# EAGLE design OSD-board (EAGLE 7.2.0)
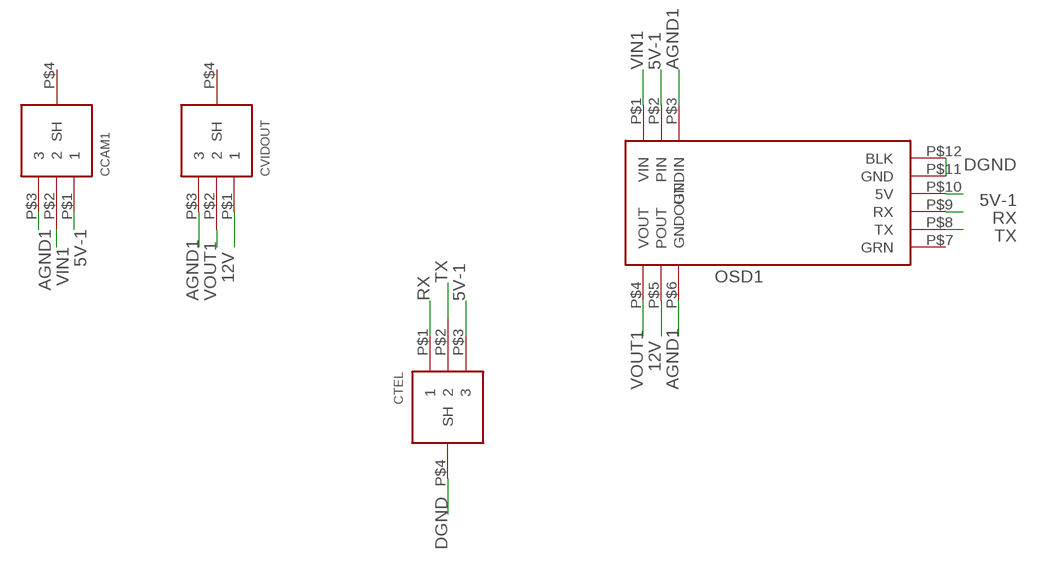
[diagram p0: schematic, sheet 1]

## Parts
CCAM1  TRA3M  [TRA3M]
CTEL  TRA3MBARE  [TRA3M-BARE]
CVIDOUT  TRA3M  [TRA3M]
OSD1  MINIM-OSD  [MINIM-OSD]

## Nets
5V-1: CCAM1.P$1 CTEL.P$3 OSD1.P$2(PIN) OSD1.P$10(5V)
12V: CVIDOUT.P$1 OSD1.P$5(POUT)
AGND1: CCAM1.P$3 CVIDOUT.P$3 OSD1.P$3(GNDIN) OSD1.P$6(GNDOUT)
DGND: CTEL.P$4(SH) OSD1.P$11(GND) OSD1.P$12(BLK)
RX: CTEL.P$1 OSD1.P$9(RX)
TX: CTEL.P$2 OSD1.P$8(TX)
VIN1: CCAM1.P$2 OSD1.P$1(VIN)
VOUT1: CVIDOUT.P$2 OSD1.P$4(VOUT)
Unconnected: CCAM1.P$4(SH) CVIDOUT.P$4(SH) OSD1.P$7(GRN)

## Library data of the parts
CCAM1 CTEL CVIDOUT = custom-parts:TRA3M
OSD1 = custom-parts:MINIM-OSD

## Board
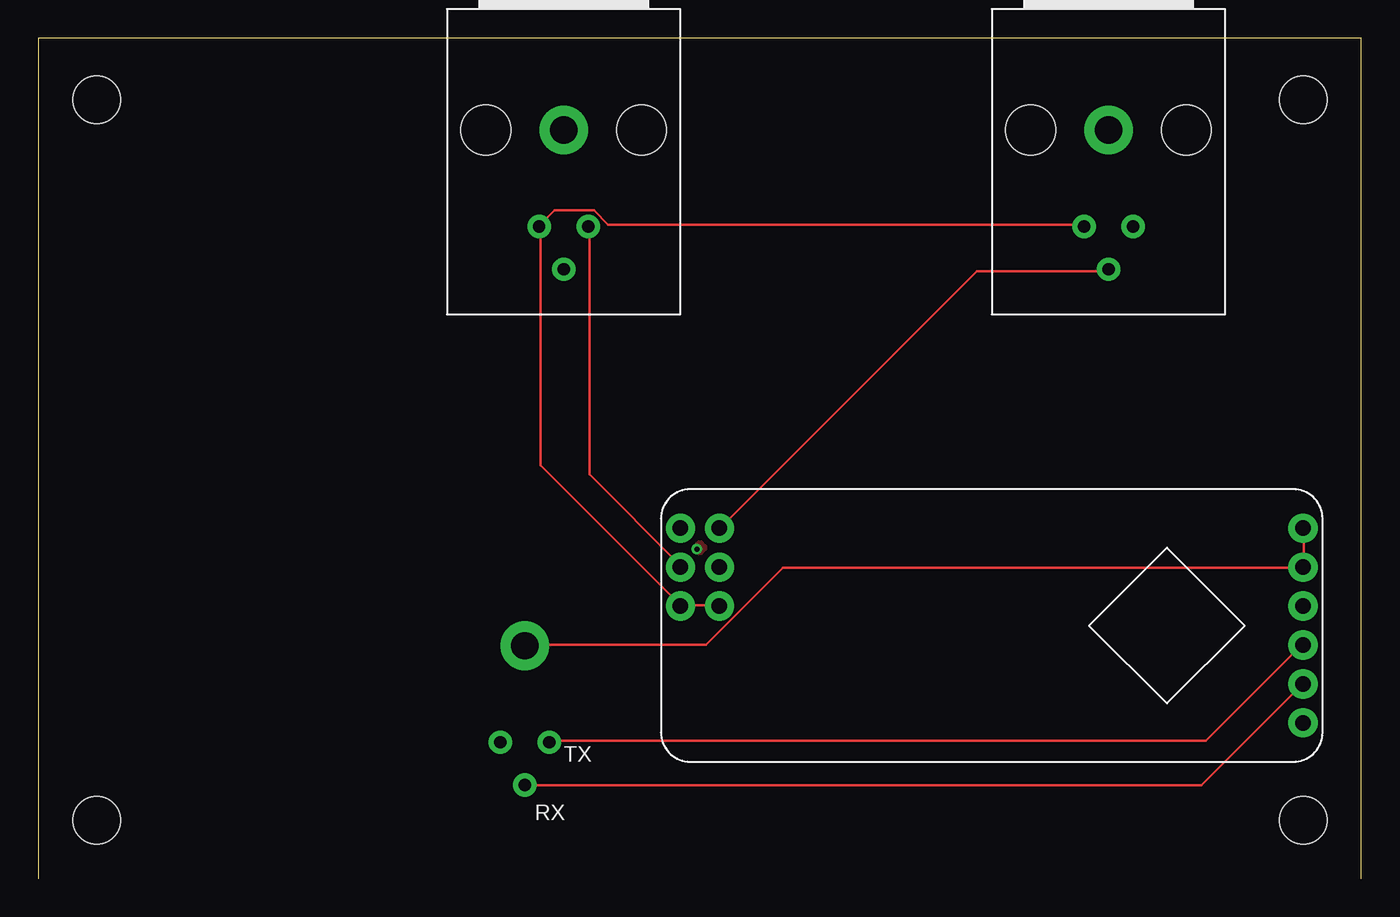
[diagram p1: board, top side]
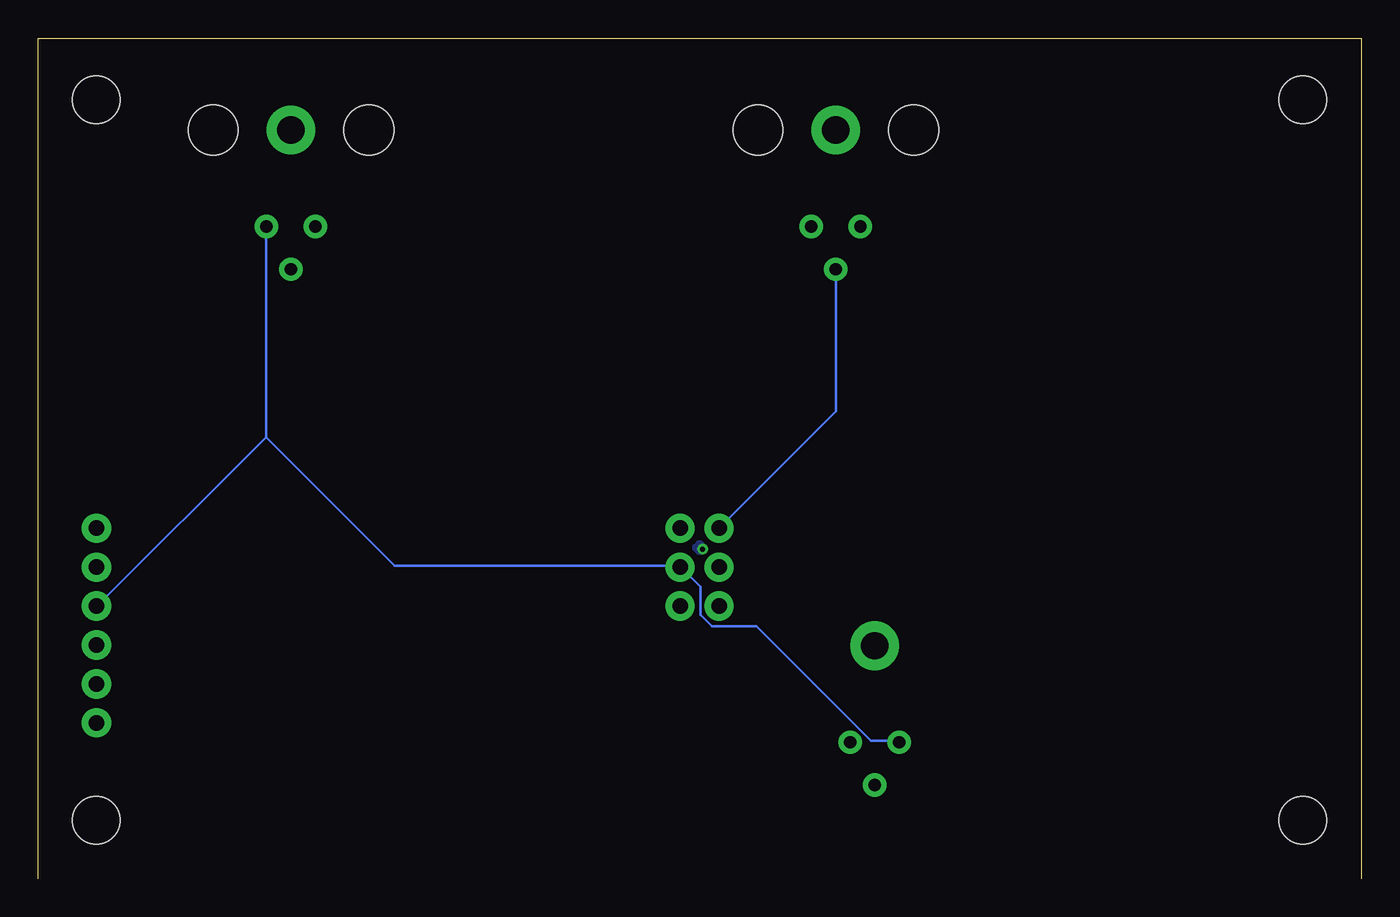
[diagram p2: board, bottom side, seen from below]

Size 86.34 x 54.82 mm. Coordinates in mm from the lower left corner, seen from the top.
Outline: 86.34,0 86.34,54.82 0,54.82 0,0
Copper layers (1*16): Top 0.0356mm / dielectric 1.5011mm / Bottom 0.0356mm
Design rules "default": minimum track width 6mil, minimum drill 13mil, track to track 6mil, track to pad 6mil, pad to pad 6mil, via to via 6mil, smd to smd 6mil, copper to edge 15mil, drill to drill 6mil, minimum pad ring 7mil, minimum via ring 7mil, stop-mask expansion 4mil, vias tented up to drill 0mil, thermal gap 10mil
Holes 3.1 mm at 3.81,3.81 3.81,50.8 82.55,50.8 82.55,3.81

### Footprints (pad centres in the part's own frame; a part is rotated, then mirrored left to right if it is on the bottom)
TRA3M = drill 0.8 pad 1.524: P$1 0,-1.6; P$2 -2.794,0; P$3 0,1.6 | drill 1.778 pad 3.175: P$4 6.299,0 | hole 3.251: 6.299,5.08; 6.299,-5.08
TRA3M-BARE = drill 0.8 pad 1.524: P$1 0,-1.6; P$2 -2.794,0; P$3 0,1.6 | drill 1.778 pad 3.175: P$4 6.299,0
MINIM-OSD = drill 1.016 pad 1.905: P$1 39.37,2.54; P$2 39.37,5.08; P$3 39.37,7.62; P$4 41.91,2.54; P$5 41.91,5.08; P$6 41.91,7.62; P$7 1.27,15.24; P$8 1.27,12.7; P$9 1.27,10.16; P$10 1.27,7.62; P$11 1.27,5.08; P$12 1.27,2.54

### Placement (x,y rotation side)
CCAM1  69.85,42.55 90 top
CTEL  31.75,8.89 90 top
CVIDOUT  34.29,42.55 90 top
OSD1  83.82,25.4 180 top

### Tracks (layer width: path | path; a pad name or v marks a point on that pad's centre or on a via)
5V-1
  Bottom 0.152: CTEL.P$3 30.18,8.99 32,8.99 39.47,16.46 42.37,16.46 43.13,17.22 43.13,19.05 44.35,20.27 OSD1.P$2 44.5,20.42 63.09,20.42 71.48,28.8 | 71.48,28.8 71.48,42.52 CCAM1.P$1 | 71.48,28.8 82.45,17.83 OSD1.P$10
12V
  Top 0.152: CVIDOUT.P$1 35.97,42.52 35.97,26.36 41.91,20.42 OSD1.P$5
AGND1
  Top 0.152: 41.91,17.83 32.77,26.98 32.77,42.52 CVIDOUT.P$3 32.77,42.67 33.68,43.59 36.27,43.59 37.19,42.67 68.12,42.67 CCAM1.P$3 | 41.91,17.83 44.35,17.83 OSD1.P$3 | 41.91,17.83 OSD1.P$6
DGND
  Top 0.152: OSD1.P$12 82.6,22.86 82.6,20.42 OSD1.P$11 82.45,20.27 48.62,20.27 43.59,15.24 31.85,15.24 CTEL.P$4
RX
  Top 0.152: CTEL.P$1 33.38,8.99 76.2,8.99 82.45,15.24 OSD1.P$9
SHLD  (via drill 0.33)
  Bottom 0.152: 43.13,21.34 v42.98,21.49
  pour Bottom (isolate 0.406): 0,54.61 86.36,54.61 86.36,0 0,0
  pour Top (isolate 0.406): 0,0 86.36,0 86.36,54.61 0,54.61
TX
  Top 0.152: CTEL.P$2 75.89,6.1 82.45,12.65 OSD1.P$8
VIN1
  Top 0.152: CCAM1.P$2 69.8,39.62 61.27,39.62 44.5,22.86 OSD1.P$1
VOUT1
  Bottom 0.152: CVIDOUT.P$2 34.29,30.48 OSD1.P$4

### Text on the board
tNames: TX | RX